# Altium project Portal-Radio-PCB.PrjPcb
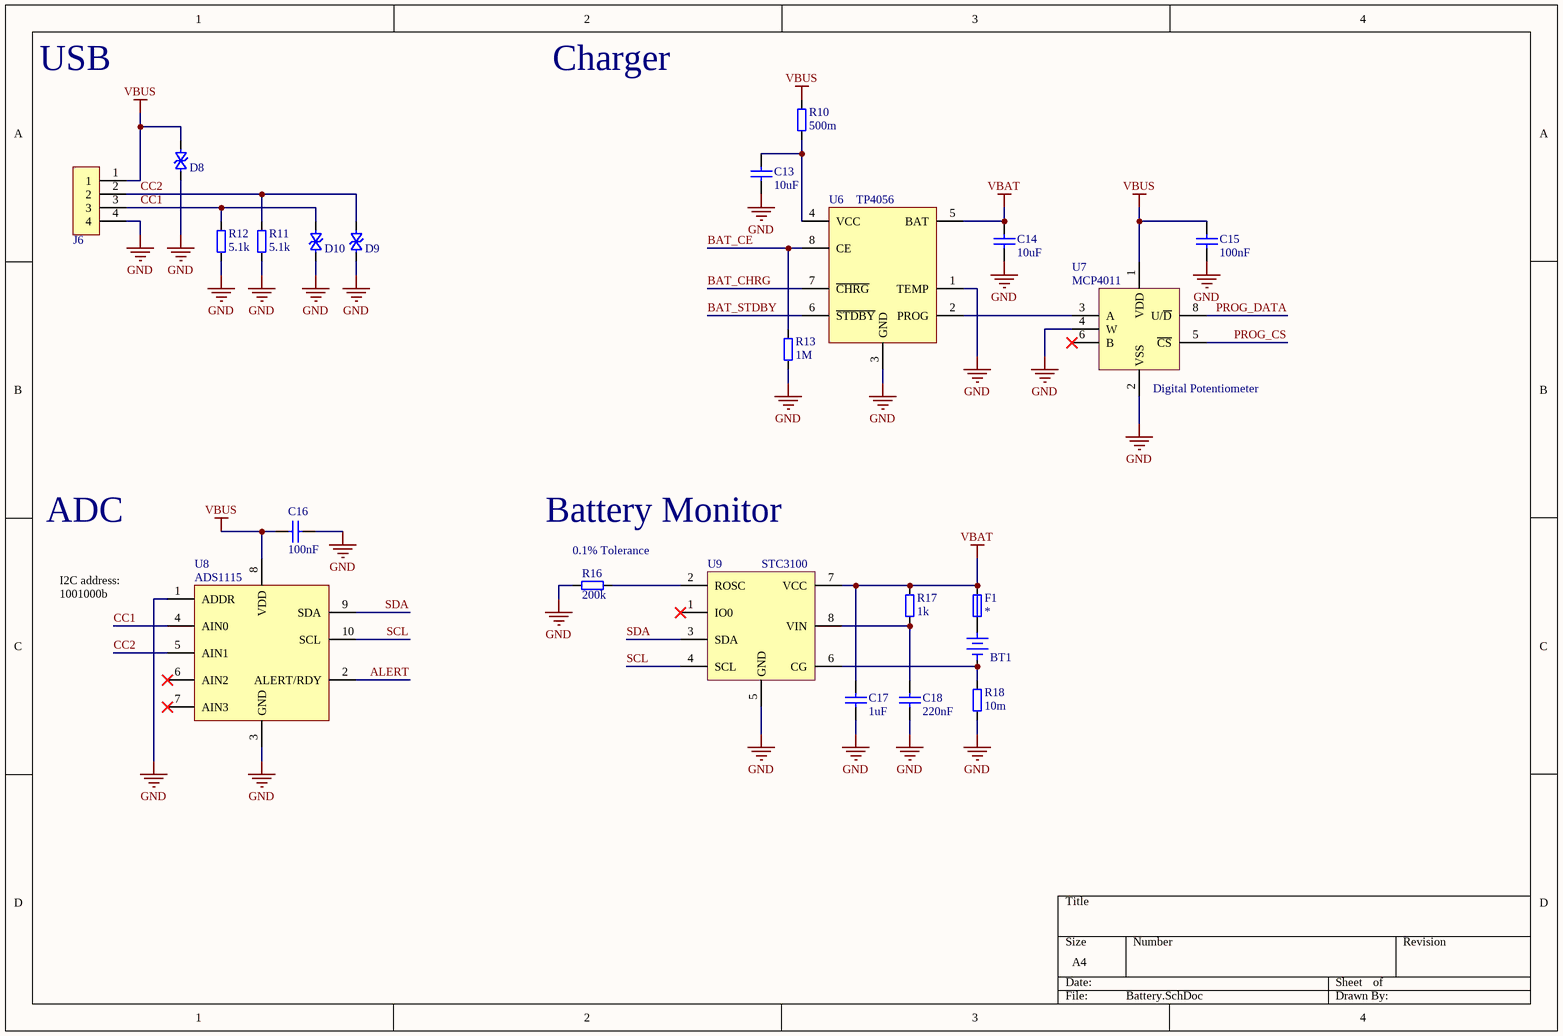
[diagram p0: Battery.SchDoc]
4 sheets, 103 parts. Net scope: global (net labels, ports and power ports of the same name join across sheets).
Board files: PortalPCB.PcbDoc, IOBoard.PcbDoc
Sheets:
  Battery.SchDoc
  Power.SchDoc
  Main.SchDoc
  Audio.SchDoc

## Sheet Battery.SchDoc
size A4; SheetNumber: 1; SheetTotal: 4

### Parts
BT1  18650  [1x2 Header]  (value not drawn)
C13  Capacitance: 10uF  [CAP 0805]  (hidden comment: Capacitor_10uF)
C14  Capacitance: 10uF  [CAP 0805]  (hidden comment: Capacitor_10uF)
C15  Capacitance: 100nF  [CAP 0805]  (hidden comment: Capacitor_100nF)
C16  Capacitance: 100nF  [CAP 0805]  (hidden comment: Capacitor_100nF)
C17  Capacitance: 1uF  [CAP 0805]  (hidden comment: Capacitor_1uF)
C18  Capacitance: 220nF  [CAP 0805]  (hidden comment: Capacitor_220nF)
D8  Diode_TVS_Bi  [DIOM4226X24N]  (value not drawn)
D9  Diode_TVS_Bi  [DIOM4226X24N]  (value not drawn)
D10  Diode_TVS_Bi  [DIOM4226X24N]  (value not drawn)
F1  Fuse  [RES 0805]  (value not drawn)
J6  1x4 Header  [1x4 Header]  (value not drawn)
R10  Resistance: 500m  [Axial Resistor THT]  (hidden comment: Resistor_500m)
R11  Resistance: 5.1k  [RES 0805]  (hidden comment: Resistor_5.1k)
R12  Resistance: 5.1k  [RES 0805]  (hidden comment: Resistor_5.1k)
R13  Resistance: 1M  [RES 0805]  (hidden comment: Resistor_1M)
R16  Resistance: 200k  [RES 0805]  (hidden comment: Resistor_200k)
R17  Resistance: 1k  [RES 0805]  (hidden comment: Resistor_1k)
R18  Resistance: 10m  [RES 0805]  (hidden comment: Resistor_10m)
U6  TP4056  [SOP-8N w/ Thermal Pad]
U7  MCP4011  [TSOP65P490X110-8N]
U8  ADS1115  [TSSOP50P490X110-10N]
U9  STC3100  [TSOP65P490X110-8N]

### Nets
GND: C13.1 C14.1 C15.1 C16.1 C17.2 C18.1 D8.2 D9.2 D10.2 J6.4 R11.1 R12.1 R13.1 R16.1 R18.1 U6.1(TEMP) U6.3(GND) U7.2(VSS) U7.4(W) U8.1(ADDR) U8.3(GND) U9.5(GND)
VBAT: C14.2 C17.1 F1.2 R17.2 U6.5(BAT) U9.7(VCC)
VBUS: C15.2 C16.2 D8.1 J6.1 R10.2 U7.1(VDD) U8.8(VDD)
ALERT: U8.2(ALERT/RDY)
BAT_CE: R13.2 U6.8(CE)
BAT_CHRG: U6.7(~{CHRG})
BAT_STDBY: U6.6(~{STDBY})
CC1: D10.1 J6.3 R12.2 U8.4(AIN0)
CC2: D9.1 J6.2 R11.2 U8.5(AIN1)
PROG_CS: U7.5(~{CS})
PROG_DATA: U7.8(U/~{D})
SCL: U8.10(SCL) U9.4(SCL)
SDA: U8.9(SDA) U9.3(SDA)
NetBT1_1: BT1.1 F1.1
NetBT1_2: BT1.2 R18.2 U9.6(CG)
NetC13_2: C13.2 R10.1 U6.4(VCC)
NetC18_2: C18.2 R17.1 U9.8(VIN)
NetR16_2: R16.2 U9.2(ROSC)
NetU6_2: U6.2(PROG) U7.3(A)

Not connected (* = marked no-connect by the designer): U7 6(B)*; U8 6(AIN2)* 7(AIN3)*; U9 1(IO0)*

### Notes on the sheet
- USB
- Charger
- (near U7) Digital Potentiometer
- ADC
- Battery Monitor
- (near R16) 0.1% Tolerance
- I2C address:
  1001000b

### Library data of the parts
J6 = 1x4_Header
U7 = MCP4011: Digital POT
U8 = ADS1115: 16-bit, ADC, I2C
F1 = Fuse: Trip Current: *

## Sheet Power.SchDoc
size A4; SheetNumber: 2; SheetTotal: 4
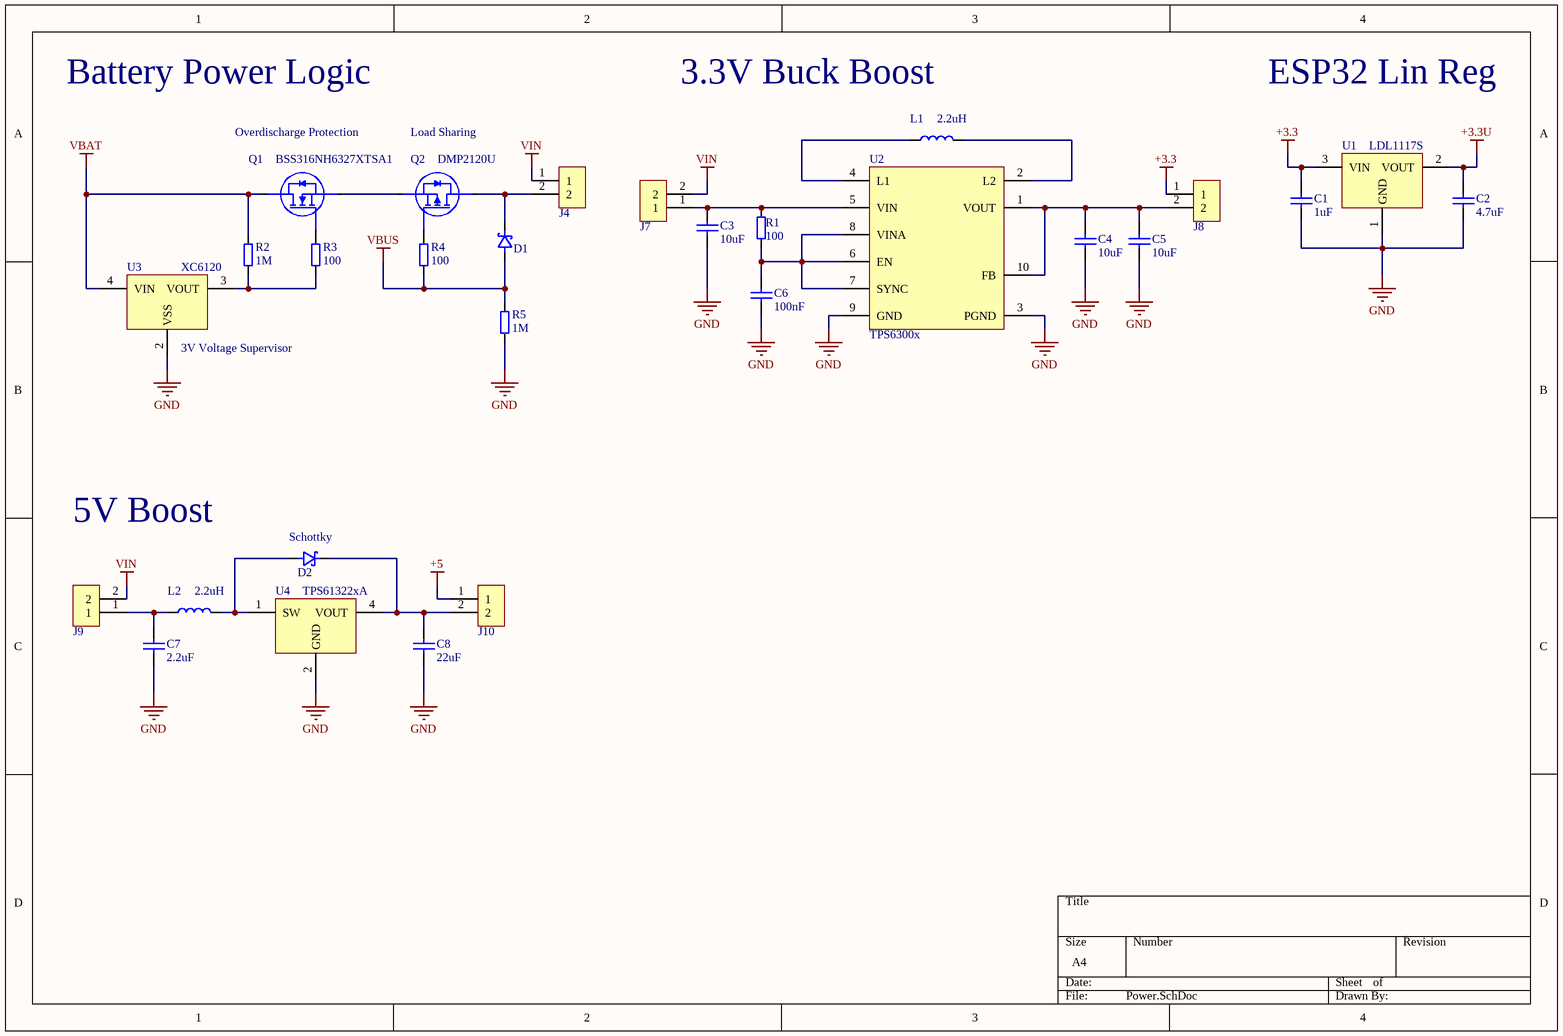
[diagram p1: Power.SchDoc]

### Parts
C1  Capacitance: 1uF  [CAP 0805]  (hidden comment: Capacitor_1uF)
C2  Capacitance: 4.7uF  [CAP 0805]  (hidden comment: Capacitor_4.7uF)
C3  Capacitance: 10uF  [CAP 0805]  (hidden comment: Capacitor_10uF)
C4  Capacitance: 10uF  [CAP 0805]  (hidden comment: Capacitor_10uF)
C5  Capacitance: 10uF  [CAP 0805]  (hidden comment: Capacitor_10uF)
C6  Capacitance: 100nF  [CAP 0805]  (hidden comment: Capacitor_100nF)
C7  Capacitance: 2.2uF  [CAP 0805]  (hidden comment: Capacitor_2.2uF)
C8  Capacitance: 22uF  [CAP 0805]  (hidden comment: Capacitor_22uF)
D1  Diode_Schottky  [DIOM4226X24N]  (value not drawn)
D2  Diode_Schottky  [DIOM4226X24N]  (value not drawn)
J4  1x2 Header  [1x2Header]  (value not drawn)
J7  1x2 Header  [1x2Header]  (value not drawn)
J8  1x2 Header  [1x2Header]  (value not drawn)
J9  1x2 Header  [1x2Header]  (value not drawn)
J10  1x2 Header  [1x2Header]  (value not drawn)
L1  Inductance: 2.2uH  [INDP7575X45N]  (hidden comment: Inductor_2.2uH)
L2  Inductance: 2.2uH  [INDP7575X45N]  (hidden comment: Inductor_2.2uH)
Q1  BSS316NH6327XTSA1  [SOT95P245X110-3N]
Q2  DMP2120U  [SOT95P245X110-3N]
R1  Resistance: 100  [RES 0805]  (hidden comment: Resistor_100)
R2  Resistance: 1M  [RES 0805]  (hidden comment: Resistor_1M)
R3  Resistance: 100  [RES 0805]  (hidden comment: Resistor_100)
R4  Resistance: 100  [RES 0805]  (hidden comment: Resistor_100)
R5  Resistance: 1M  [RES 0805]  (hidden comment: Resistor_1M)
U1  LDL1117S  [SOT223 (Custom)]
U2  TPS6300x  [QFN50P300X300X100_HS-11N]
U3  XC6120  [TSOP130P210X100-4N]
U4  TPS61322xA  [SOT95P280X145-5N]

### Nets
+3.3: C1.2 J8.1 U1.3(VIN)
+3.3U: C2.2 U1.2(VOUT)
+5: J10.1
GND: C1.1 C2.1 C3.1 C4.1 C5.1 C6.1 C7.1 C8.1 R5.2 U1.1(GND) U2.3(PGND) U2.9(GND) U3.2(VSS) U4.2(GND)
VBAT: Q1.3 R2.1 U3.4(VIN)
VBUS: D1.1 R4.2 R5.1
VIN: J4.1 J7.2 J9.2
NetC3_2: C3.2 J7.1 R1.2 U2.5(VIN)
NetC4_2: C4.2 C5.2 J8.2 U2.1(VOUT) U2.10(FB)
NetC6_2: C6.2 R1.1 U2.6(EN) U2.7(SYNC) U2.8(VINA)
NetC7_2: C7.2 J9.1 L2.1
NetC8_2: C8.2 D2.2 J10.2 U4.4(VOUT)
NetD1_2: D1.2 J4.2 Q2.3
NetD2_1: D2.1 L2.2 U4.1(SW)
NetL1_1: L1.1 U2.4(L1)
NetL1_2: L1.2 U2.2(L2)
NetQ1_1: Q1.1 R3.1
NetQ1_2: Q1.2 Q2.2
NetQ2_1: Q2.1 R4.1
NetR2_2: R2.2 R3.2 U3.3(VOUT)

### Notes on the sheet
- Battery Power Logic
- (near L1) 3.3V Buck Boost
- ESP32 Lin Reg
- Overdischarge Protection
- Load Sharing
- (near U3) 3V Voltage Supervisor
- 5V Boost
- (near D2) Schottky

### Library data of the parts
J4 J7-J10 = 1x2_Header
Q1 = BSS316NH6327XTSA1: N-Channel MOSFET
Q2 = DMP2120U: P-Channel MOSFET
U1 = LDL1117S: LDO Linear Regulator
U2 = TPS6300x: Buck-Boost Converter
U3 = XC6120: Voltage Supervisor
U4 = TPS61322xA: Boost Converter

## Sheet Main.SchDoc
size A4; SheetNumber: 3; SheetTotal: 4
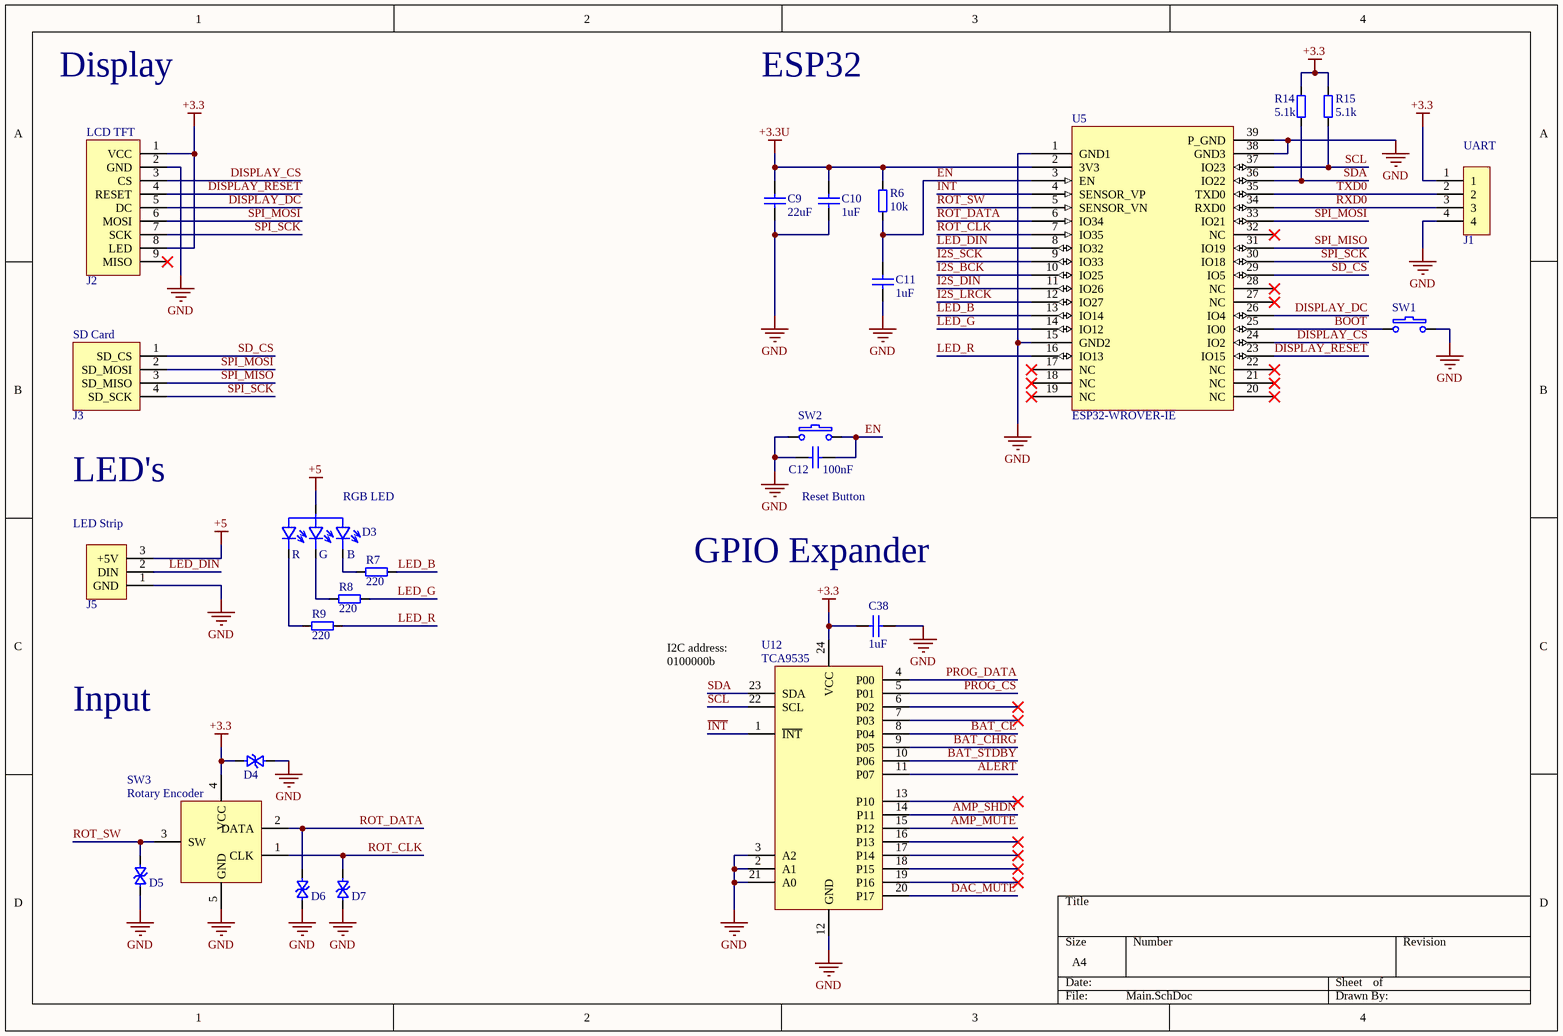
[diagram p2: Main.SchDoc]

### Parts
C9  Capacitance: 22uF  [CAP 0805]  (hidden comment: Capacitor_22uF)
C10  Capacitance: 1uF  [CAP 0805]  (hidden comment: Capacitor_1uF)
C11  Capacitance: 1uF  [CAP 0805]  (hidden comment: Capacitor_1uF)
C12  Capacitance: 100nF  [CAP 0805]  (hidden comment: Capacitor_100nF)
C38  Capacitance: 1uF  [CAP 0805]  (hidden comment: Capacitor_1uF)
D3  LED_RGB  [4Pin]  (value not drawn)
D4  Diode_TVS_Bi  [DIOM4226X24N]  (value not drawn)
D5  Diode_TVS_Bi  [DIOM4226X24N]  (value not drawn)
D6  Diode_TVS_Bi  [DIOM4226X24N]  (value not drawn)
D7  Diode_TVS_Bi  [DIOM4226X24N]  (value not drawn)
J1  1x4 Header  [1x4 Header]  (value not drawn)
J2  1x4 Header  [1X9 HEADER]  (value not drawn)
J3  1x4 Header  [1x4 Header]  (value not drawn)
J5  1x3_Header  [1x3Header]  (value not drawn)
R6  Resistance: 10k  [RES 0805]  (hidden comment: Resistor_10k)
R7  Resistance: 220  [RES 0805]  (hidden comment: Resistor_220)
R8  Resistance: 220  [RES 0805]  (hidden comment: Resistor_220)
R9  Resistance: 220  [RES 0805]  (hidden comment: Resistor_220)
R14  Resistance: 5.1k  [RES 0805]  (hidden comment: Resistor_5.1k)
R15  Resistance: 5.1k  [RES 0805]  (hidden comment: Resistor_5.1k)
SW1  Switch_PB  [2Pin]  (value not drawn)
SW2  Switch_PB  [2Pin]  (value not drawn)
SW3  Rotary Encoder  [1x5 Header]
U5  ESP32-WROVER-IE  [ESP32 WROVER]
U12  TCA9535  [TSOP65P640X120-24N]

### Nets
+3.3: C38.2 D4.1 J1.1 J2.1(VCC) J2.8(LED) R14.2 R15.2 SW3.4(VCC) U12.24(VCC)
+3.3U: C9.2 C10.2 R6.2 U5.2(3V3)
+5: D3.2(Anode) J5.3(+5V)
GND: C9.1 C10.1 C11.1 C12.1 C38.1 D4.2 D5.2 D6.2 D7.2 J1.4 J2.2(GND) J5.1(GND) SW1.2 SW2.1 SW3.5(GND) U5.1(GND1) U5.15(GND2) U5.38(GND3) U5.39(P_GND) U12.2(A1) U12.3(A2) U12.12(GND) U12.21(A0)
ALERT: U12.11(P07)
AMP_~{MUTE}: U12.15(P12)
AMP_~{SHDN}: U12.14(P11)
BAT_CE: U12.8(P04)
BAT_CHRG: U12.9(P05)
BAT_STDBY: U12.10(P06)
BOOT: SW1.1 U5.25(IO0)
DAC_MUTE: U12.20(P17)
DISPLAY_CS: J2.3(CS) U5.24(IO2)
DISPLAY_DC: J2.5(DC) U5.26(IO4)
DISPLAY_RESET: J2.4(RESET) U5.23(IO15)
EN: C11.2 C12.2 R6.1 SW2.2 U5.3(EN)
I2S_BCK: U5.10(IO25)
I2S_DIN: U5.11(IO26)
I2S_LRCK: U5.12(IO27)
I2S_SCK: U5.9(IO33)
~{INT}: U5.4(SENSOR_VP) U12.1(~{INT})
LED_B: R7.1 U5.13(IO14)
LED_DIN: J5.2(DIN) U5.8(IO32)
LED_G: R8.1 U5.14(IO12)
LED_R: R9.1 U5.16(IO13)
PROG_CS: U12.5(P01)
PROG_DATA: U12.4(P00)
ROT_CLK: D7.1 SW3.1(CLK) U5.7(IO35)
ROT_DATA: D6.1 SW3.2(DATA) U5.6(IO34)
ROT_SW: D5.1 SW3.3(SW) U5.5(SENSOR_VN)
RXD0: J1.3 U5.34(RXD0)
SCL: R15.1 U5.37(IO23) U12.22(SCL)
SD_CS: J3.1(SD_CS) U5.29(IO5)
SDA: R14.1 U5.36(IO22) U12.23(SDA)
SPI_MISO: J3.3(SD_MISO) U5.31(IO19)
SPI_MOSI: J2.6(MOSI) J3.2(SD_MOSI) U5.33(IO21)
SPI_SCK: J2.7(SCK) J3.4(SD_SCK) U5.30(IO18)
TXD0: J1.2 U5.35(TXD0)
NetD3_1: D3.1(Red) R9.2
NetD3_3: D3.3(Green) R8.2
NetD3_4: D3.4(Blue) R7.2

Not connected (* = marked no-connect by the designer): J2 9(MISO)*; U5 17(NC)* 18(NC)* 19(NC)* 20(NC)* 21(NC)* 22(NC)* 27(NC)* 28(NC)* 32(NC)*; U12 6(P02)* 7(P03)* 13(P10)* 16(P13)* 17(P14)* 18(P15)* 19(P16)*

### Notes on the sheet
- Display
- ESP32
- (near J2) LCD TFT
- (near J1) UART
- (near J3) SD Card
- LED's
- (near D3) RGB LED
- Reset Button
- (near J5) LED Strip
- GPIO Expander
- Input
- (near U12) I2C address:
  0100000b
- (in symbol LED_RGB) R; G; B

### Library data of the parts
J1 = 1x4_Header
J2 = 1x9_Header TFT Screen
J3 = 1x4_Header SD Card
J5 = 1x3_Header WS2812B
U12 = TCA9535: I2C GPIO Expander

## Sheet Audio.SchDoc
size A4; SheetNumber: 4; SheetTotal: 4
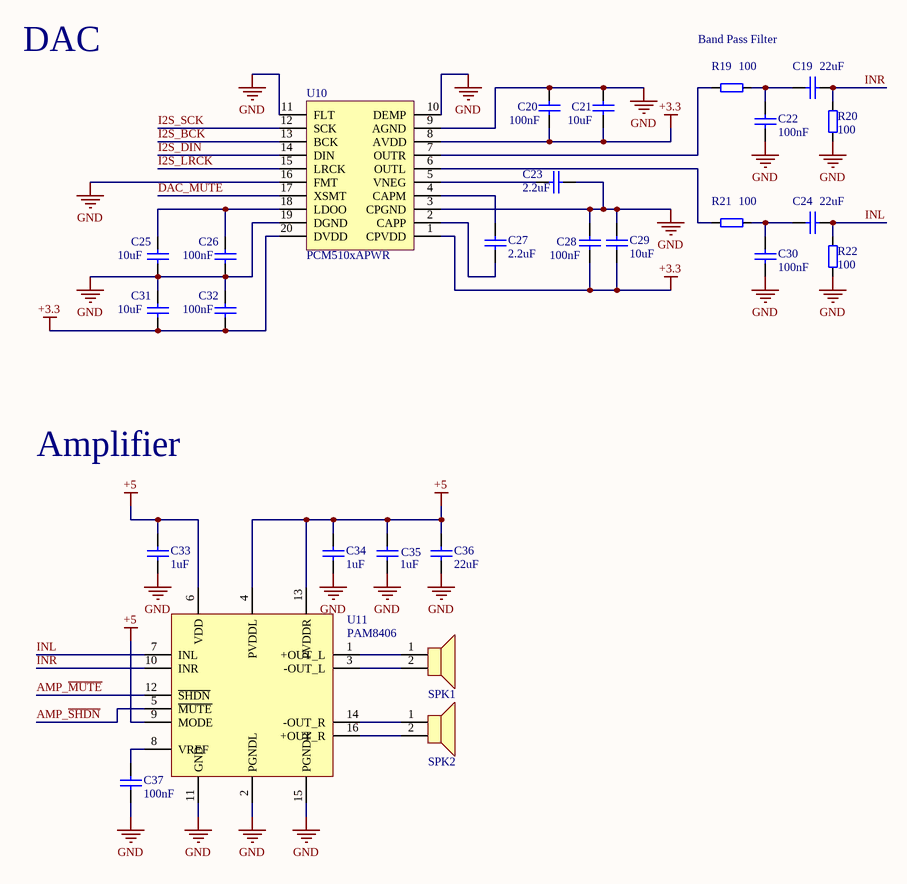
[diagram p3: Audio.SchDoc]

### Parts
C19  Capacitance: 22uF  [CAP 0805]  (hidden comment: Capacitor_22uF)
C20  Capacitance: 100nF  [CAP 0805]  (hidden comment: Capacitor_100nF)
C21  Capacitance: 10uF  [CAP 0805]  (hidden comment: Capacitor_10uF)
C22  Capacitance: 100nF  [CAP 0805]  (hidden comment: Capacitor_100nF)
C23  Capacitance: 2.2uF  [CAP 0805]  (hidden comment: Capacitor_2.2uF)
C24  Capacitance: 22uF  [CAP 0805]  (hidden comment: Capacitor_22uF)
C25  Capacitance: 10uF  [CAP 0805]  (hidden comment: Capacitor_10uF)
C26  Capacitance: 100nF  [CAP 0805]  (hidden comment: Capacitor_100nF)
C27  Capacitance: 2.2uF  [CAP 0805]  (hidden comment: Capacitor_2.2uF)
C28  Capacitance: 100nF  [CAP 0805]  (hidden comment: Capacitor_100nF)
C29  Capacitance: 10uF  [CAP 0805]  (hidden comment: Capacitor_10uF)
C30  Capacitance: 100nF  [CAP 0805]  (hidden comment: Capacitor_100nF)
C31  Capacitance: 10uF  [CAP 0805]  (hidden comment: Capacitor_10uF)
C32  Capacitance: 100nF  [CAP 0805]  (hidden comment: Capacitor_100nF)
C33  Capacitance: 1uF  [CAP 0805]  (hidden comment: Capacitor_1uF)
C34  Capacitance: 1uF  [CAP 0805]  (hidden comment: Capacitor_1uF)
C35  Capacitance: 1uF  [CAP 0805]  (hidden comment: Capacitor_1uF)
C36  Capacitance: 22uF  [CAP 0805]  (hidden comment: Capacitor_22uF)
C37  Capacitance: 100nF  [CAP 0805]  (hidden comment: Capacitor_100nF)
R19  Resistance: 100  [RES 0805]  (hidden comment: Resistor_100)
R20  Resistance: 100  [RES 0805]  (hidden comment: Resistor_100)
R21  Resistance: 100  [RES 0805]  (hidden comment: Resistor_100)
R22  Resistance: 100  [RES 0805]  (hidden comment: Resistor_100)
SPK1  Speaker  [2Pin]  (value not drawn)
SPK2  Speaker  [2Pin]  (value not drawn)
U10  PCM510xAPWR  [TSOP-20]
U11  PAM8406  [SOP-16N]

### Nets
+3.3: C20.1 C21.1 C28.1 C29.1 C31.1 C32.1 U10.1(CPVDD) U10.8(AVDD) U10.20(DVDD)
+5: C33.2 C34.2 C35.2 C36.2 U11.4(PVDDL) U11.6(VDD) U11.9(MODE) U11.13(PVDDR)
GND: C20.2 C21.2 C22.1 C23.1 C25.1 C26.1 C28.2 C29.2 C30.1 C31.2 C32.2 C33.1 C34.1 C35.1 C36.1 C37.1 R20.1 R22.1 U10.3(CPGND) U10.9(AGND) U10.10(DEMP) U10.11(FLT) U10.16(FMT) U10.19(DGND) U11.2(PGNDL) U11.11(GND) U11.15(PGNDR)
AMP_~{MUTE}: U11.12(~{SHDN})
AMP_~{SHDN}: U11.5(~{MUTE})
DAC_MUTE: U10.17(XSMT)
I2S_BCK: U10.13(BCK)
I2S_DIN: U10.14(DIN)
I2S_LRCK: U10.15(LRCK)
I2S_SCK: U10.12(SCK)
INL: C24.2 R22.2 U11.7(INL)
INR: C19.2 R20.2 U11.10(INR)
NetC19_1: C19.1 C22.2 R19.2
NetC23_2: C23.2 U10.5(VNEG)
NetC24_1: C24.1 C30.2 R21.2
NetC25_2: C25.2 C26.2 U10.18(LDOO)
NetC27_1: C27.1 U10.4(CAPM)
NetC27_2: C27.2 U10.2(CAPP)
NetC37_2: C37.2 U11.8(VREF)
NetR19_1: R19.1 U10.7(OUTR)
NetR21_1: R21.1 U10.6(OUTL)
NetSPK1_1: SPK1.1 U11.1(+OUT_L)
NetSPK1_2: SPK1.2 U11.3(-OUT_L)
NetSPK2_1: SPK2.1 U11.14(-OUT_R)
NetSPK2_2: SPK2.2 U11.16(+OUT_R)

### Notes on the sheet
- DAC
- Band Pass Filter
- Amplifier

## Nets that join several sheets
+3.3: Power (C1.2 J8.1 U1.3), Main (9 pins), Audio (9 pins)
+3.3U: Power (C2.2 U1.2), Main (C9.2 C10.2 R6.2 U5.2)
+5: Power (J10.1), Main (D3.2 J5.3), Audio (8 pins)
GND: Battery (22 pins), Power (14 pins), Main (23 pins), Audio (27 pins)
VBAT: Battery (6 pins), Power (Q1.3 R2.1 U3.4)
VBUS: Battery (7 pins), Power (D1.1 R4.2 R5.1)
ALERT: Battery (U8.2), Main (U12.11)
AMP_~{MUTE}: Main (U12.15), Audio (U11.12)
AMP_~{SHDN}: Main (U12.14), Audio (U11.5)
BAT_CE: Battery (R13.2 U6.8), Main (U12.8)
BAT_CHRG: Battery (U6.7), Main (U12.9)
BAT_STDBY: Battery (U6.6), Main (U12.10)
DAC_MUTE: Main (U12.20), Audio (U10.17)
I2S_BCK: Main (U5.10), Audio (U10.13)
I2S_DIN: Main (U5.11), Audio (U10.14)
I2S_LRCK: Main (U5.12), Audio (U10.15)
I2S_SCK: Main (U5.9), Audio (U10.12)
PROG_CS: Battery (U7.5), Main (U12.5)
PROG_DATA: Battery (U7.8), Main (U12.4)
SCL: Battery (U8.10 U9.4), Main (R15.1 U5.37 U12.22)
SDA: Battery (U8.9 U9.3), Main (R14.1 U5.36 U12.23)